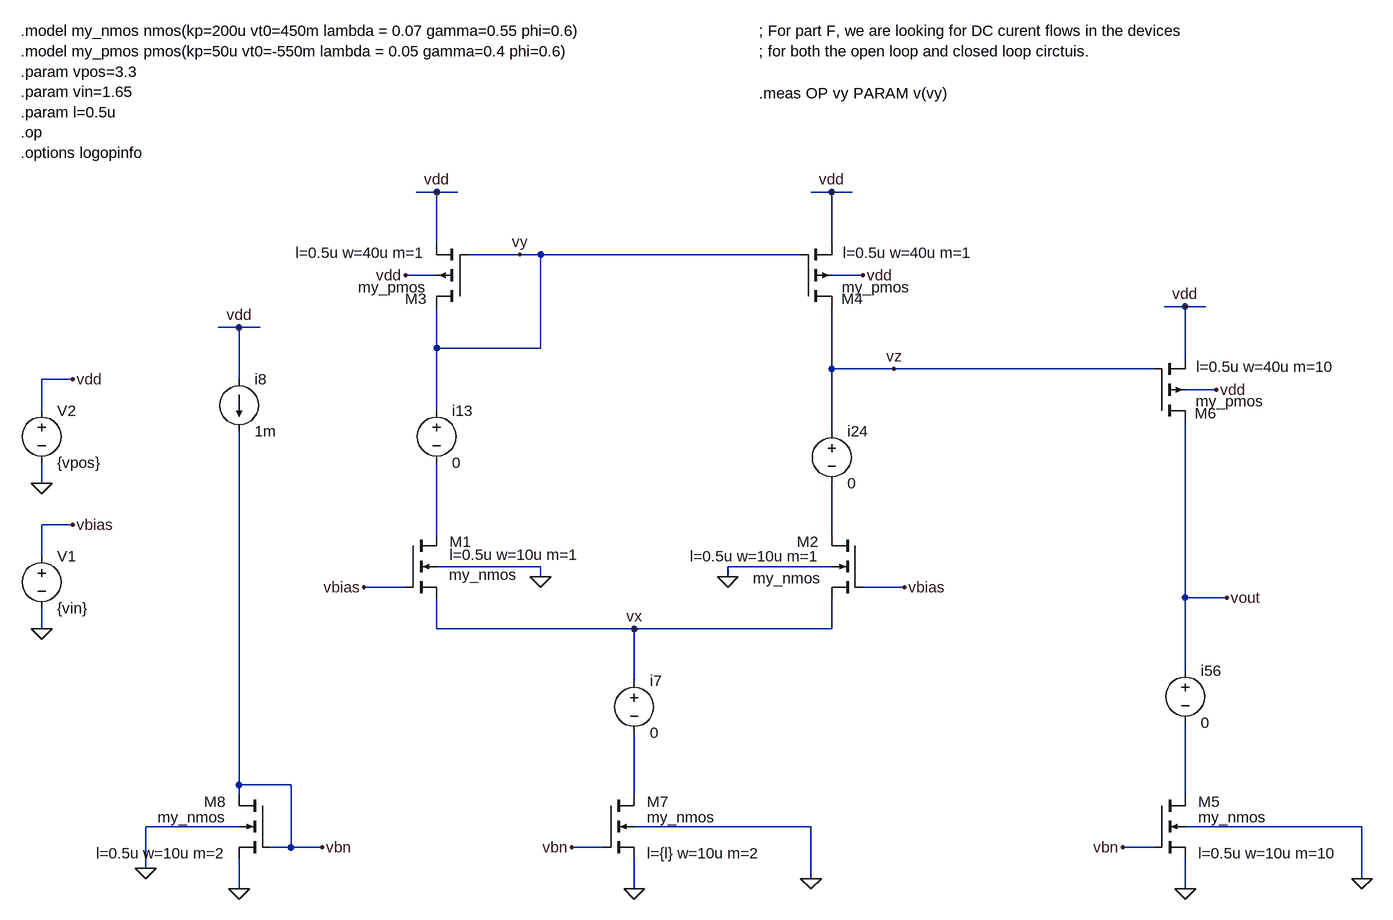
[diagram p0: schematic example_closed_loop.asc]
example_closed_loop.asc, the LTspice schematic file:
Version 4.1
SHEET 1 1348 680
WIRE -96 -512 -128 -512
WIRE -64 -512 -96 -512
WIRE 512 -512 480 -512
WIRE 544 -512 512 -512
WIRE -96 -432 -96 -512
WIRE 512 -432 512 -512
WIRE 32 -416 -48 -416
WIRE 64 -416 32 -416
WIRE 464 -416 64 -416
WIRE -96 -384 -144 -384
WIRE 560 -384 512 -384
WIRE 1056 -336 1024 -336
WIRE 1088 -336 1056 -336
WIRE -400 -304 -432 -304
WIRE -368 -304 -400 -304
WIRE -96 -272 -96 -336
WIRE 64 -272 64 -416
WIRE 64 -272 -96 -272
WIRE 1056 -256 1056 -336
WIRE 512 -240 512 -336
WIRE 608 -240 512 -240
WIRE 1008 -240 608 -240
WIRE -656 -224 -704 -224
WIRE -400 -224 -400 -304
WIRE 1104 -208 1056 -208
WIRE -704 -176 -704 -224
WIRE -96 -176 -96 -272
WIRE 512 -144 512 -240
WIRE -704 -64 -704 -96
WIRE -656 0 -704 0
WIRE -96 16 -96 -96
WIRE 512 16 512 -64
WIRE -704 48 -704 0
WIRE 64 64 -96 64
WIRE 512 64 352 64
WIRE 64 80 64 64
WIRE 352 80 352 64
WIRE -144 96 -208 96
WIRE 624 96 560 96
WIRE 1056 112 1056 -160
WIRE 1120 112 1056 112
WIRE -704 160 -704 128
WIRE -96 160 -96 112
WIRE 208 160 -96 160
WIRE 512 160 512 112
WIRE 512 160 208 160
WIRE 1056 224 1056 112
WIRE 208 240 208 160
WIRE -400 400 -400 -144
WIRE -320 400 -400 400
WIRE -400 416 -400 400
WIRE 208 416 208 320
WIRE 1056 416 1056 304
WIRE -400 464 -544 464
WIRE 480 464 208 464
WIRE 1328 464 1056 464
WIRE -320 496 -320 400
WIRE -320 496 -352 496
WIRE -272 496 -320 496
WIRE 160 496 112 496
WIRE 1008 496 960 496
WIRE -544 528 -544 464
WIRE 480 544 480 464
WIRE 1328 544 1328 464
WIRE -400 560 -400 512
WIRE 208 560 208 512
WIRE 1056 560 1056 512
FLAG -272 496 vbn
FLAG -544 528 0
FLAG -400 560 0
FLAG 1056 560 0
FLAG -96 -512 vdd
FLAG 512 -512 vdd
FLAG 1056 -336 vdd
FLAG -144 -384 vdd
FLAG 560 -384 vdd
FLAG 1104 -208 vdd
FLAG 32 -416 vy
FLAG 608 -240 vz
FLAG -208 96 vbias
FLAG -656 0 vbias
FLAG 1120 112 vout
FLAG -400 -304 vdd
FLAG 624 96 vbias
FLAG -704 160 0
FLAG -656 -224 vdd
FLAG -704 -64 0
FLAG 208 160 vx
FLAG 64 80 0
FLAG 352 80 0
FLAG 112 496 vbn
FLAG 960 496 vbn
FLAG 1328 544 0
FLAG 208 560 0
FLAG 480 544 0
SYMBOL pmos4 -48 -336 R180
WINDOW 0 63 12 Left 2
WINDOW 3 64 30 Left 2
WINDOW 123 65 83 Left 2
SYMATTR InstName M3
SYMATTR Value my_pmos
SYMATTR Value2 l=0.5u w=40u m=1
SYMBOL nmos4 -144 16 R0
WINDOW 0 68 10 Left 2
WINDOW 3 67 61 Left 2
WINDOW 123 68 30 Left 2
SYMATTR InstName M1
SYMATTR Value my_nmos
SYMATTR Value2 l=0.5u w=10u m=1
SYMBOL nmos4 560 16 M0
WINDOW 0 68 10 Left 2
WINDOW 3 64 66 Left 2
WINDOW 123 66 32 Left 2
SYMATTR InstName M2
SYMATTR Value my_nmos
SYMATTR Value2 l=0.5u w=10u m=1
SYMBOL nmos4 -352 416 M0
WINDOW 0 68 10 Left 2
WINDOW 3 68 34 Left 2
WINDOW 123 68 89 Left 2
SYMATTR InstName M8
SYMATTR Value my_nmos
SYMATTR Value2 l=0.5u w=10u m=2
SYMBOL nmos4 160 416 R0
WINDOW 0 68 10 Left 2
WINDOW 3 68 34 Left 2
WINDOW 123 68 89 Left 2
SYMATTR InstName M7
SYMATTR Value my_nmos
SYMATTR Value2 l={l} w=10u m=2
SYMBOL nmos4 1008 416 R0
WINDOW 0 68 10 Left 2
WINDOW 3 68 34 Left 2
WINDOW 123 68 89 Left 2
SYMATTR InstName M5
SYMATTR Value my_nmos
SYMATTR Value2 l=0.5u w=10u m=10
SYMBOL pmos4 464 -336 M180
WINDOW 0 63 12 Left 2
WINDOW 3 64 30 Left 2
WINDOW 123 65 83 Left 2
SYMATTR InstName M4
SYMATTR Value my_pmos
SYMATTR Value2 l=0.5u w=40u m=1
SYMBOL pmos4 1008 -160 M180
WINDOW 0 63 12 Left 2
WINDOW 3 64 30 Left 2
WINDOW 123 65 83 Left 2
SYMATTR InstName M6
SYMATTR Value my_pmos
SYMATTR Value2 l=0.5u w=40u m=10
SYMBOL current -400 -224 R0
WINDOW 123 0 0 Left 0
WINDOW 39 0 0 Left 0
SYMATTR InstName i8
SYMATTR Value 1m
SYMBOL voltage -704 32 R0
SYMATTR InstName V1
SYMATTR Value {vin}
SYMBOL voltage -96 -192 R0
WINDOW 123 0 0 Left 0
WINDOW 39 0 0 Left 0
SYMATTR InstName i13
SYMATTR Value 0
SYMBOL voltage 512 -160 R0
WINDOW 123 0 0 Left 0
WINDOW 39 0 0 Left 0
SYMATTR InstName i24
SYMATTR Value 0
SYMBOL voltage 1056 208 R0
WINDOW 123 0 0 Left 0
WINDOW 39 0 0 Left 0
SYMATTR InstName i56
SYMATTR Value 0
SYMBOL voltage 208 224 R0
WINDOW 123 0 0 Left 0
WINDOW 39 0 0 Left 0
SYMATTR InstName i7
SYMATTR Value 0
SYMBOL voltage -704 -192 R0
WINDOW 123 0 0 Left 0
WINDOW 39 0 0 Left 0
SYMATTR InstName V2
SYMATTR Value {vpos}
TEXT -736 -760 Left 2 !.model my_nmos nmos(kp=200u vt0=450m lambda = 0.07 gamma=0.55 phi=0.6)\n.model my_pmos pmos(kp=50u vt0=-550m lambda = 0.05 gamma=0.4 phi=0.6)\n.param vpos=3.3\n.param vin=1.65\n.param l=0.5u\n.op\n.options logopinfo
TEXT 400 -760 Left 2 !; For part F, we are looking for DC curent flows in the devices\n; for both the open loop and closed loop circtuis.
TEXT 400 -664 Left 2 !.meas OP vy PARAM v(vy)

The netlist it stands for:
* example_closed_loop.asc
M3 vy vy vdd vdd my_pmos l=0.5u w=40u m=1
M1 N001 vbias vx 0 my_nmos l=0.5u w=10u m=1
M2 N002 vbias vx 0 my_nmos l=0.5u w=10u m=1
M8 vbn vbn 0 0 my_nmos l=0.5u w=10u m=2
M7 N003 vbn 0 0 my_nmos l={l} w=10u m=2
M5 N004 vbn 0 0 my_nmos l=0.5u w=10u m=10
M4 vz vy vdd vdd my_pmos l=0.5u w=40u m=1
M6 vout vz vdd vdd my_pmos l=0.5u w=40u m=10
i8 vdd vbn 1m
V1 vbias 0 {vin}
V§i13 vy N001 0
V§i24 vz N002 0
V§i56 vout N004 0
V§i7 vx N003 0
V2 vdd 0 {vpos}
.model NMOS NMOS
.model PMOS PMOS
.lib standard.mos
.model my_nmos nmos(kp=200u vt0=450m lambda = 0.07 gamma=0.55 phi=0.6)
.model my_pmos pmos(kp=50u vt0=-550m lambda = 0.05 gamma=0.4 phi=0.6)
.param vpos=3.3
.param vin=1.65
.param l=0.5u
.op
.options logopinfo
; For part F, we are looking for DC curent flows in the devices
; for both the open loop and closed loop circtuis.
.meas OP vy PARAM v(vy)
.backanno
.end